# EAGLE schematic 01 (EAGLE 7.7.0)
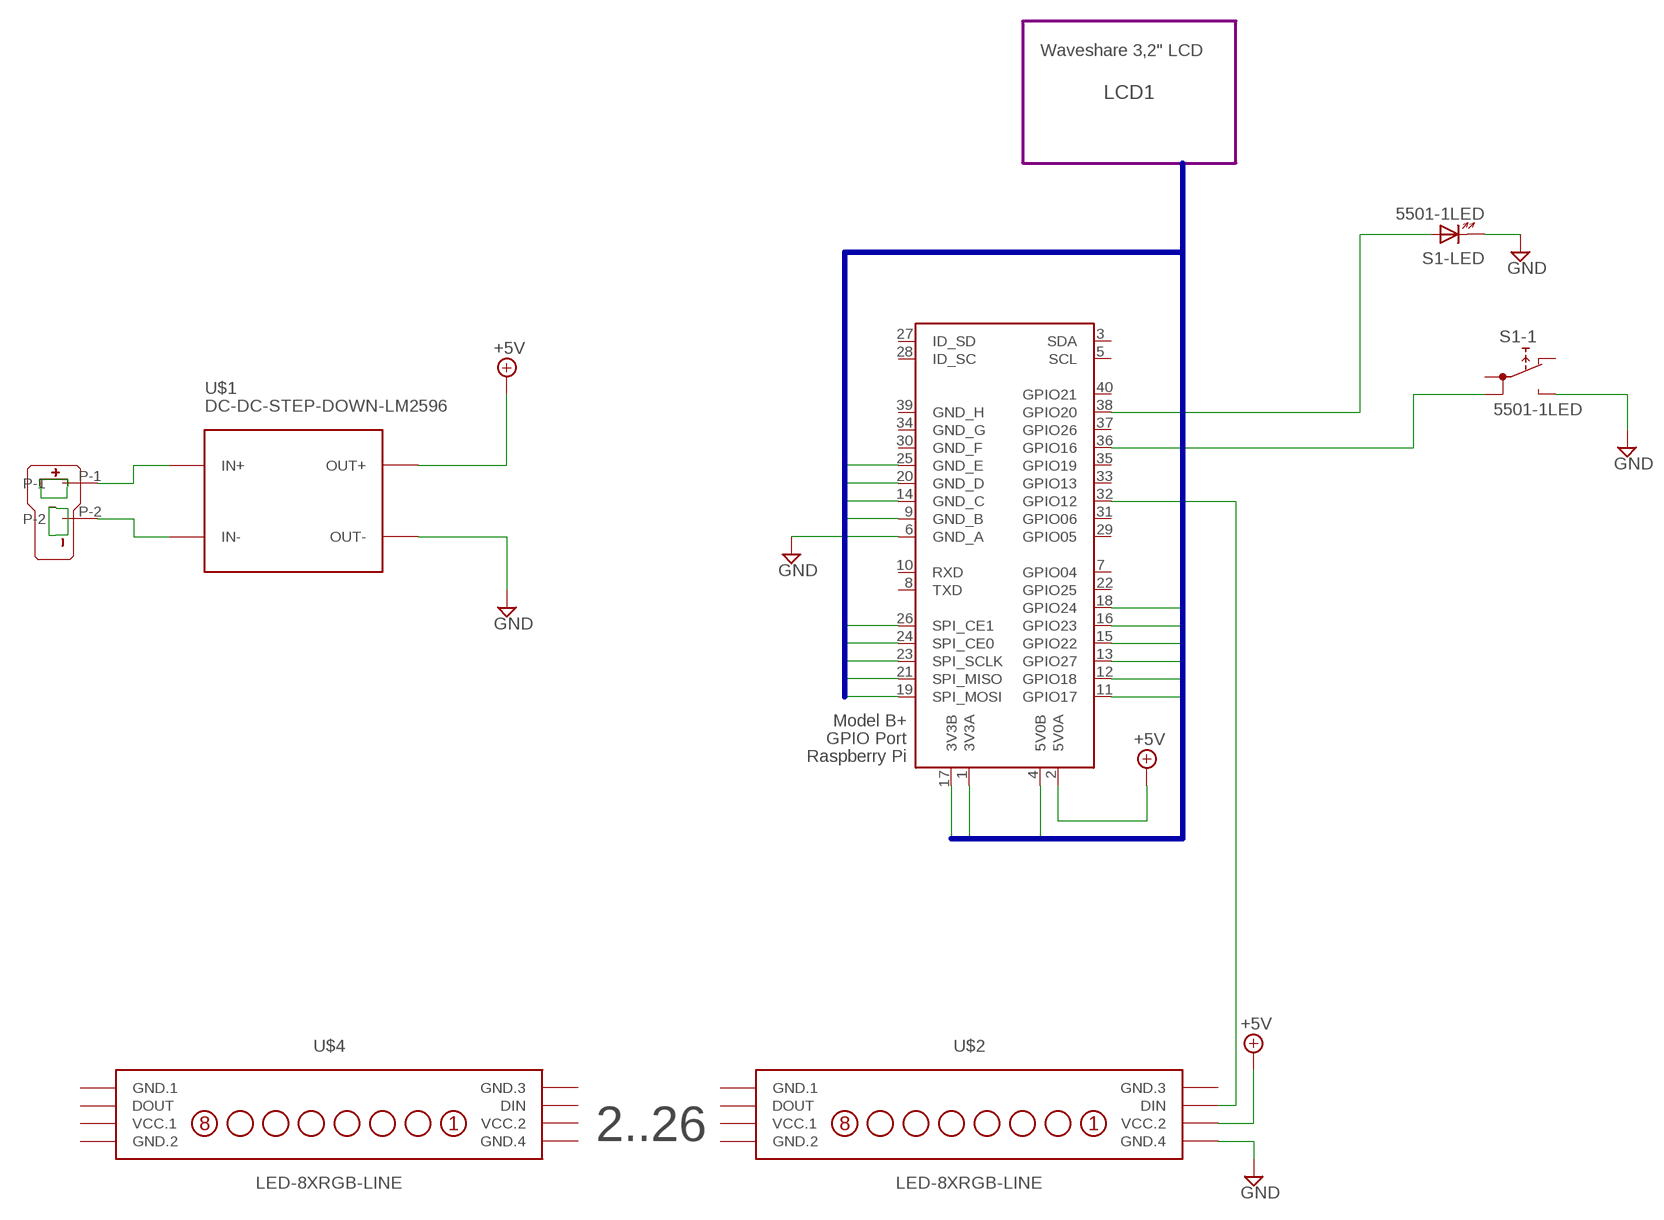
[diagram p0: schematic, sheet 1]

## Parts
S1  5501-1LED  [5501-1LED]
U$1  DC-DC-STEP-DOWN-LM2596  [DC-DC-STEP-DOWN-LM2596]
U$2  LED-8XRGB-LINE  [LED-8XRGB-LINE]
U$3  T-PLUG_CONNECTOR  [T_PLUG_CONNECTOR]
U$4  LED-8XRGB-LINE  [LED-8XRGB-LINE]
X2  RASPI_BOARD_B+#_FP  [RASPI_BOARD_B+_FULL_PAD]

## Module instances
LCD1 = LCD

## Nets
+5V: U$1.OUT+ U$2.B.3(VCC.2) X2.2(5V0A)
B$1: X2.1(3V3A) X2.4(5V0B) X2.9(GND_B) X2.11(GPIO17) X2.12(GPIO18) X2.13(GPIO27) X2.14(GND_C) X2.15(GPIO22) X2.16(GPIO23) X2.17(3V3B) X2.18(GPIO24) X2.19(SPI_MOSI) X2.20(GND_D) X2.21(SPI_MISO) X2.23(SPI_SCLK) X2.24(SPI_CE0) X2.25(GND_E) X2.26(SPI_CE1)
GND: S1.-(-LED:K) S1.NO(-1:NO) U$1.OUT- U$2.B.4(GND.4) X2.6(GND_A)
N$1: U$1.IN- U$3.P-2
N$2: U$1.IN+ U$3.P-1
N$3: U$2.B.2(DIN) X2.32(GPIO12)
N$4: S1.1B(-1:1B) X2.36(GPIO16)
N$5: S1.+(-LED:A) X2.38(GPIO20)
Unconnected: S1.1A(-1:1A) S1.NC(-1:NC) U$2.A.2(DOUT) U$4.A.2(DOUT) U$4.B.2(DIN) X2.3(SDA) X2.5(SCL) X2.7(GPIO04) X2.8(TXD) X2.10(RXD) X2.22(GPIO25) X2.27(ID_SD) X2.28(ID_SC) X2.29(GPIO05) X2.31(GPIO06) X2.33(GPIO13) X2.35(GPIO19) X2.37(GPIO26) X2.40(GPIO21)

## Buses
B$1

## Notes on the sheet
- Waveshare 3,2" LCD
- 2..26

## Power pins joined to a net without a drawn wire
GND.1: U$2.A.1(GND.1) U$4.A.1(GND.1)
GND.2: U$2.A.4(GND.2) U$4.A.4(GND.2)
GND.3: U$2.B.1(GND.3) U$4.B.1(GND.3)
GND.4: U$4.B.4(GND.4)
GND_F: X2.30(GND_F)
GND_G: X2.34(GND_G)
GND_H: X2.39(GND_H)
VCC.1: U$2.A.3(VCC.1) U$4.A.3(VCC.1)
VCC.2: U$4.B.3(VCC.2)

## Library data of the parts
S1 = switch:55?-1LED: PUSHBUTTON SERIES 5500 SWITCHES 1 LED Source: www.e-switch.com .. 5500.pdf
U$1 = diy-modules:DC-DC-STEP-DOWN-LM2596: DC/DC Step-Down Regulator based on LM2596-ADJ chip LM2596 datasheet available here: http://www.ti.com/lit/ds/symlink/lm2596.pdf Click here to find device on ebay.com <http://www.ebay.com/sch/lm2596+power+regulator>
U$2 U$4 = diy-modules:LED-8XRGB-LINE: 8 LEDs RGB Line Display based on WS2812B More details about controlling WS2812B RGB LEDs are available here: https://learn.sparkfun.com/tutorials/ws2812-breakout-hookup-guide Click here to find device on ebay.com <http://www.ebay.com/sch/ws2812+8+bit+rainbow>
U$3 = con-T-plug:T-PLUG_CONNECTOR
X2 = raspberrypi_bastelstube_v13:RASPI_BOARD_B+#: Raspberry Pi GPIO connector with markings for the outer dimensions of the Raspberry Pi board model B+ with different sets of drill holes or mounting pads All pins connected

## Module LCD
Ports: 

### Library data of the parts